# EAGLE design main (EAGLE 9.1.1)
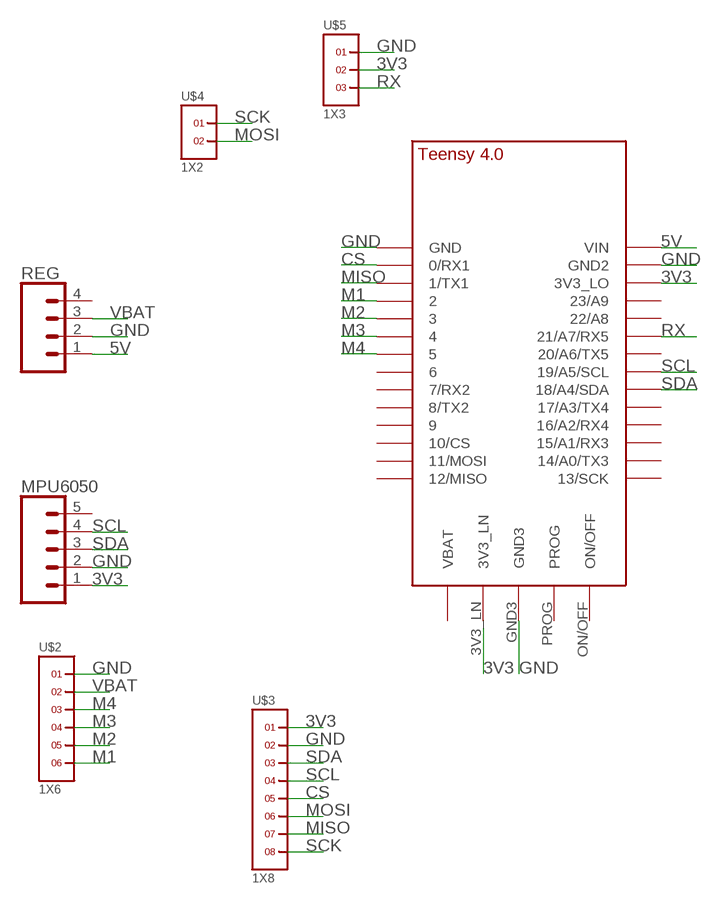
[diagram p0: schematic, sheet 1]

## Parts
MPU6050  CONN_05NO_SILK  [1X05_NO_SILK]
REG  CONN_041X04_NO_SILK  [1X04_NO_SILK]
U$1  TEENSY_4.0  [TEENSY_4.0]
U$2  1X6  [1X6]
U$3  1X8  [1X8]
U$4  1X2  [1X2]
U$5  1X3  [1X3]

## Nets
3V3: MPU6050.1 U$1.3V3_LN U$1.3V3_LO U$3.1 U$5.2
5V: REG.1 U$1.VIN
CS: U$1.0/RX(0/RX1) U$3.5
GND: MPU6050.2 REG.2 U$1.GND U$1.GND2 U$1.GND3 U$2.1 U$3.2 U$5.1
M1: U$1.2 U$2.6
M2: U$1.3/CANTX U$2.5
M3: U$1.4/CANRX U$2.4
M4: U$1.5 U$2.3
MISO: U$1.1/TX(1/TX1) U$3.7
MOSI: U$3.6 U$4.2
RX: U$1.21/A7(21/A7/RX5) U$5.3
SCK: U$3.8 U$4.1
SCL: MPU6050.4 U$1.19/A5/SCL U$3.4
SDA: MPU6050.3 U$1.18/A4/SDA U$3.3
VBAT: REG.3 U$2.2
Unconnected: MPU6050.5 REG.4 U$1.6 U$1.7(7/RX2) U$1.8(8/TX2) U$1.9/CS U$1.10/CS U$1.11/MOSI U$1.12/MISO U$1.13/SCK U$1.14/A0(14/A0/TX3) U$1.15/A1(15/A1/RX3) U$1.16/A2(16/A2/RX4) U$1.17/A3(17/A3/TX4) U$1.20/A6(20/A6/TX5) U$1.22/A8 U$1.23/A9 U$1.ON/OFF U$1.PROG U$1.VBAT\(VBAT)

## Library data of the parts
MPU6050 = SparkFun-Connectors:CONN_05: Multi connection point. Often used as Generic Header-pin footprint for 0.1 inch spaced/style header connections On any of the 0.1 inch spaced packages, you can populate with these: Break Away Headers - Straight <https://www.sparkfun.com/products/116> (PRT-00116) Break Away Male Headers - Right Angle <https://www.sparkfun.com/products/553> (PRT-00553) Female Headers <https://www.sparkfun.com/products/115> (PRT-00115) Break Away Headers - Machine Pin <https://www.sparkfun.com/products/117> (PRT-00117) Break Away Female Headers - Swiss Machine Pin <https://www.sparkfun.com/products/743> (PRT-00743) For SCREWTERMINALS and SPRING TERMINALS visit here: Screw Terimnals on SparkFun.com <https://www.sparkfun.com/search/results?term=Screw+Terminals> (5mm/3.5mm/2.54mm spacing) This device is also useful as a general connection point to wire up your design to another part of your project. Our various solder wires solder well into these plated through hole pads. Hook-Up Wire - Assortment (Stranded, 22 AWG) <https://www.sparkfun.com/products/11375> (PRT-11375) Hook-Up Wire - Assortment (Solid Core, 22 AWG) <https://www.sparkfun.com/products/11367> (PRT-11367) View the entire wire category on our website here <https://www.sparkfun.com/categories/141> Special notes: Molex polarized connector foot print use with SKU : PRT-08231 with associated crimp pins and housings. 1MM SMD Version SKU: PRT-10208
REG = SparkFun-Connectors:CONN_04: Multi connection point. Often used as Generic Header-pin footprint for 0.1 inch spaced/style header connections On any of the 0.1 inch spaced packages, you can populate with these: Break Away Headers - Straight <https://www.sparkfun.com/products/116> (PRT-00116) Break Away Male Headers - Right Angle <https://www.sparkfun.com/products/553> (PRT-00553) Female Headers <https://www.sparkfun.com/products/115> (PRT-00115) Break Away Headers - Machine Pin <https://www.sparkfun.com/products/117> (PRT-00117) Break Away Female Headers - Swiss Machine Pin <https://www.sparkfun.com/products/743> (PRT-00743) For SCREWTERMINALS and SPRING TERMINALS visit here: Screw Terimnals on SparkFun.com <https://www.sparkfun.com/search/results?term=Screw+Terminals> (5mm/3.5mm/2.54mm spacing) This device is also useful as a general connection point to wire up your design to another part of your project. Our various solder wires solder well into these plated through hole pads. Hook-Up Wire - Assortment (Stranded, 22 AWG) <https://www.sparkfun.com/products/11375> (PRT-11375) Hook-Up Wire - Assortment (Solid Core, 22 AWG) <https://www.sparkfun.com/products/11367> (PRT-11367) View the entire wire category on our website here <https://www.sparkfun.com/categories/141> Special notes: Molex polarized connector foot print use with SKU : PRT-08231 with associated crimp pins and housings. 1MM SMD Version SKU: PRT-10208; PROD_ID: CONN-09696
U$1 = TEENSY 4.0:TEENSY_4.0
U$2 = headers(2mm):1X6
U$3 = headers(2mm):1X8
U$4 = headers(2mm):1X2
U$5 = headers(2mm):1X3

## Board
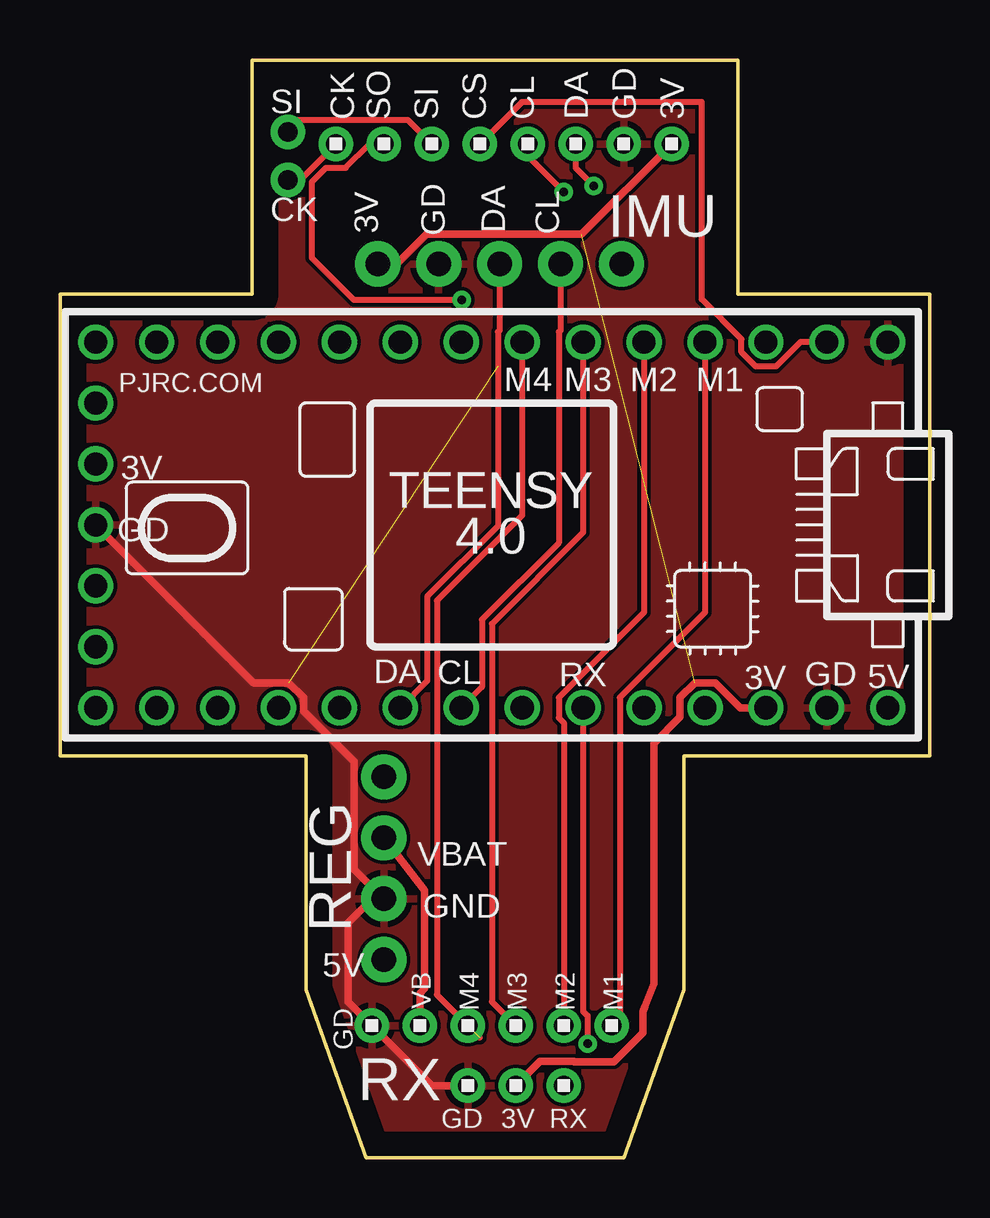
[diagram p1: board, top side]
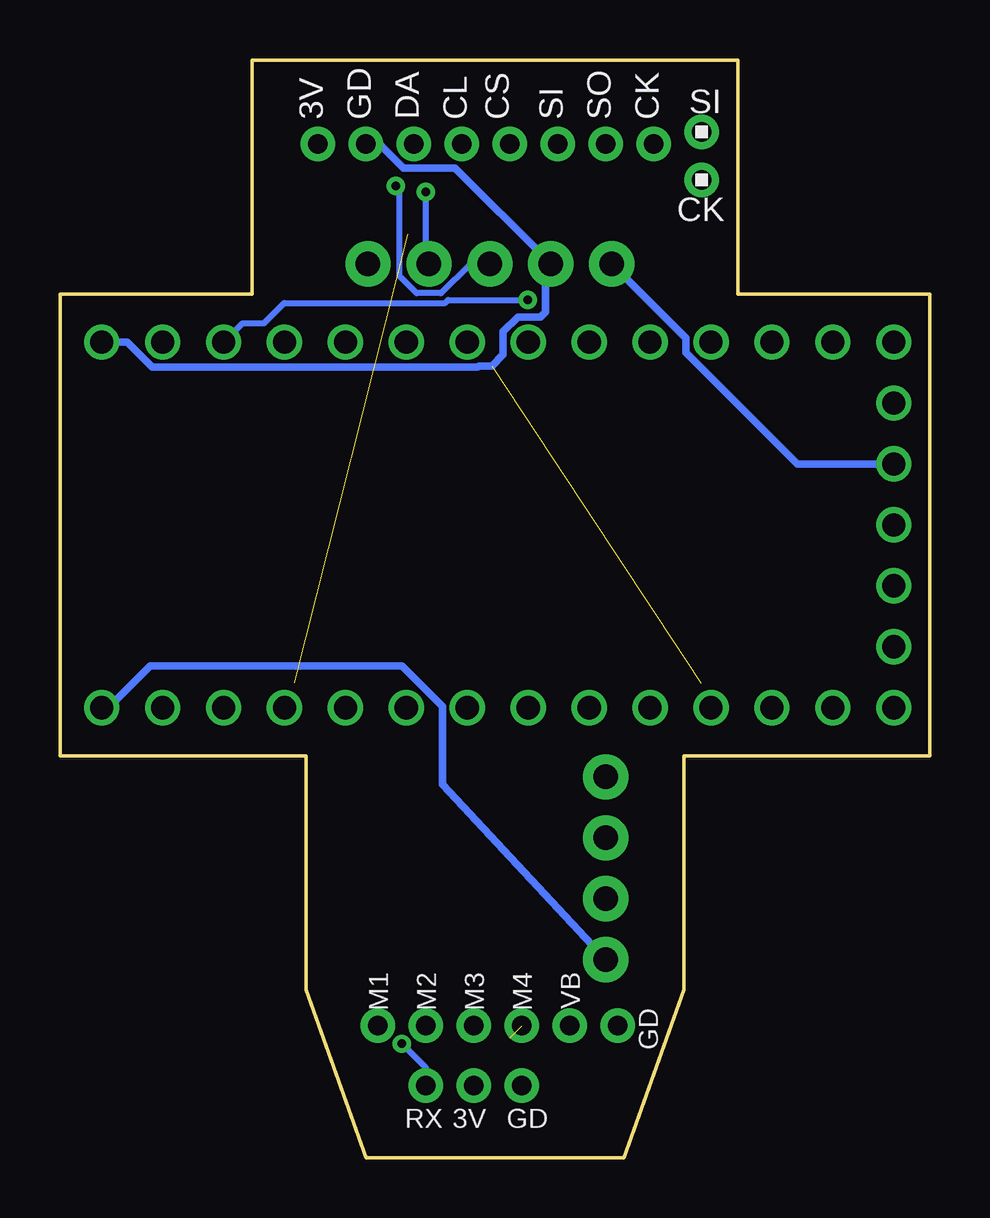
[diagram p2: board, bottom side, seen from below]

Size 36.25 x 45.75 mm. Coordinates in mm from the lower left corner, seen from the top.
Outline: 8,45.75 28.25,45.75 28.25,36 36.25,36 36.25,16.75 26,16.75 26,7 23.5,0 12.75,0 10.25,7 10.25,16.75 0,16.75 0,36 8,36 8,45.75
Copper layers (1*16): Top 0.035mm / dielectric 1.5mm / Bottom 0.035mm
Design rules "default": minimum track width 6mil, minimum drill 0.35mm, track to track 6mil, track to pad 6mil, pad to pad 6mil, via to via 6mil, smd to smd 6mil, copper to edge 40mil, drill to drill 6mil, minimum pad ring 10mil, minimum via ring 8mil, stop-mask expansion 4mil, vias tented up to drill 0mil, thermal gap 10mil

### Footprints (pad centres in the part's own frame; a part is rotated, then mirrored left to right if it is on the bottom)
1X05_NO_SILK = drill 1.016 pad 1.88: 1 0,0; 2 2.54,0; 3 5.08,0; 4 7.62,0; 5 10.16,0
1X04_NO_SILK = drill 1.016 pad 1.88: 1 0,0; 2 2.54,0; 3 5.08,0; 4 7.62,0
TEENSY_4.0 = drill 0.965: 0/RX -13.97,-7.62; 1/TX -11.43,-7.62; 2 -8.89,-7.62; 3/CANTX -6.35,-7.62; 3V3_LN 16.51,-2.54; 3V3_LO -11.43,7.62; 4/CANRX -3.81,-7.62; 5 -1.27,-7.62; 6 1.27,-7.62; 7 3.81,-7.62; 8 6.35,-7.62; 9/CS 8.89,-7.62; 10/CS 11.43,-7.62; 11/MOSI 13.97,-7.62; 12/MISO 16.51,-7.62; 13/SCK 16.51,7.62; 14/A0 13.97,7.62; 15/A1 11.43,7.62; 16/A2 8.89,7.62; 17/A3 6.35,7.62; 18/A4/SDA 3.81,7.62; 19/A5/SCL 1.27,7.62; 20/A6 -1.27,7.62; 21/A7 -3.81,7.62; 22/A8 -6.35,7.62; 23/A9 -8.89,7.62; GND -16.51,-7.62; GND2 -13.97,7.62; GND3 16.51,0; ON/OFF 16.51,5.08; PROG 16.51,2.54; VBAT\ 16.51,-5.08; VIN -16.51,7.62
1X6 = drill 0.8 pad 1.422: 1 -5,0; 2 -3,0; 3 -1,0; 4 1,0; 5 3,0; 6 5,0
1X8 = drill 0.8 pad 1.422: 1 -7,0; 2 -5,0; 3 -3,0; 4 -1,0; 5 1,0; 6 3,0; 7 5,0; 8 7,0
1X2 = drill 0.8 pad 1.422: 1 -1,0; 2 1,0
1X3 = drill 0.8 pad 1.422: 1 -2,0; 2 0,0; 3 2,0

### Placement (x,y rotation side)
MPU6050  13.25,37.25 0 top
REG  13.5,8.25 90 top
U$1  18,26.37 180 top
U$2  18,5.5 0 top
U$3  18.5,42.25 180 top
U$4  9.5,41.75 90 bottom
U$5  19,3 0 top

### Tracks (layer width: path | path; a pad name or v marks a point on that pad's centre or on a via)
3V3  (1 unrouted)
  Top 0.305: MPU6050.1 14.03,37.25 15.27,38.49 21.74,38.49 U$3.1 | U$1.3V3_LO 28.36,18.75 27.32,19.79 26.46,19.79 25.85,19.18 25.85,18.36 24.76,17.27 24.76,7.24 24.38,6.3 24.29,6.08 24.29,5.2 23.09,4 21.44,4 21.42,4.02 20.02,4.02 U$5.2
  Bottom 0.305: MPU6050.1 10.15,34.15 10.15,33.56 5.5,28.91 U$1.3V3_LN
5V
  Bottom 0.305: U$1.VIN 34.25,18.75 32.5,20.5 22,20.5 20.31,18.81 20.31,15.56 REG.1
CS
  Top 0.254: U$1.0/RX 30.87,33.99 29.85,32.97 29.01,32.97 28.41,33.57 28.41,34.11 26.75,35.78 26.75,44 19.25,44 U$3.5
GND  (1 unrouted)
  Top 0.305: MPU6050.2 16.57,37.25 | U$5.1 15.5,3 U$2.1 12,6.5 12,9.79 13.23,11.02 13.4,10.88 | 13.4,10.88 REG.2 | U$1.GND3 8.07,19.79 9.54,19.79 10.15,19.18 10.15,18.61 12.26,16.5 12.26,12.02 13.4,10.88
  Bottom 0.305: 16.02,37.48 19.77,41.23 21.92,41.23 22.94,42.25 U$3.2 | 16.02,37.48 MPU6050.2 | U$1.GND 33.44,33.99 32.4,32.95 18.84,32.95 18.79,33 18.25,33 17.77,33.48 17.77,34.42 17.16,35.03 16.22,35.03 16.02,35.23 16.02,37.48
  pour Top: 37.75,47.25 37.75,-2.75 -3,-2.75 -3,47.25 37.5,47.25
M1
  Top 0.254: U$2.6 23.33,5.83 23.33,19.17 26.89,22.73 U$1.2
M2
  Top 0.254: U$2.5 21,18.12 20.79,18.33 20.79,19.17 24.35,22.73 U$1.3/CANTX
M3
  Top 0.254: U$1.4/CANRX 21.81,26.06 18,22.25 18,6.5 U$2.4
M4  (1 unrouted)
  Top 0.254: U$1.5 19.27,26.77 15.71,23.21 15.71,6.79 17.5,5
MISO  (via drill 0.35)
  Top 0.254: v16.75,35.75 12.25,35.75 10.5,37.5 10.5,40.67 11.08,41.26 11.91,41.26 12.9,42.25 U$3.7
  Bottom 0.254: U$1.1/TX 28.64,34.78 27.74,34.78 26.9,35.62 20.2,35.62 20.07,35.75 v16.75,35.75
MOSI
  Top 0.254: U$3.6 14.5,43.25 9.75,43.25 9.75,43 U$4.2
RX  (via drill 0.35)
  Top 0.254: U$1.21/A7 21.81,6.09 21.99,5.91 21.99,4.75 v22,4.74
  Bottom 0.254: v22,4.74 21,3.74 U$5.3
SCK
  Top 0.254: U$4.1 10,40.75 U$3.8
SCL  (via drill 0.35)
  Top 0.254: v21,40.25 19.5,41.75 U$3.4 | MPU6050.4 20.87,34.49 20.79,34.41 20.79,25.62 17.59,22.42 17.59,19.61 U$1.19/A5/SCL
  Bottom 0.254: MPU6050.4 21,37.38 v21,40.25
SDA  (via drill 0.35)
  Top 0.254: v22.25,40.5 21.5,41.25 U$3.3 | MPU6050.3 18.33,34.49 18.25,34.41 18.25,26.33 15.31,23.38 15.31,19.87 U$1.18/A4/SDA
  Bottom 0.254: v22.25,40.5 22.09,40.34 22.09,36.74 21.38,36.03 20.37,36.03 19.15,37.25 MPU6050.3
VBAT
  Top 0.305: U$2.2 15,6.84 15.2,7.05 15.2,11.13 REG.3

### Text on the board
tNames: SI | CK | SO | SI | CS | CL | DA | GD | 3V | IMU | CK | 3V | GD | DA | CL | M4 | M3 | M2 | M1 | 3V | GD | DA | CL | 3V | 5V | RX | GD | VBAT | REG | GND | 5V | VB | M4 | M3 | M2 | M1 | GD | RX | GD | 3V | RX
bNames: SI | CK | SO | SI | CS | CL | DA | GD | 3V | CK | VB | M4 | M3 | M2 | M1 | GD | GD | 3V | RX